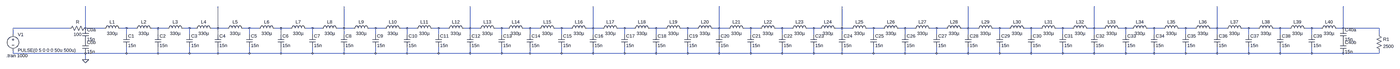
[diagram p0: schematic LTSpice Simulation.asc, whole sheet]
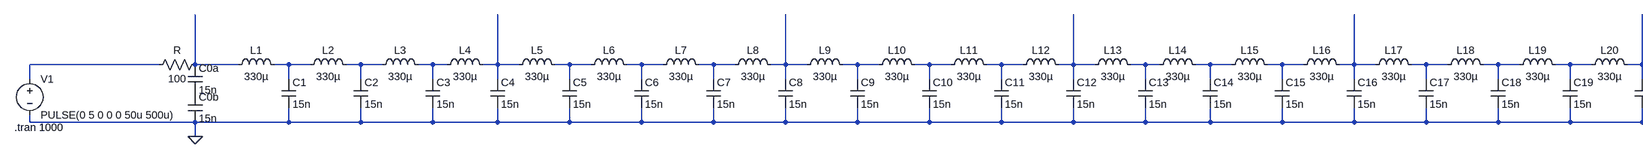
[diagram p1: schematic LTSpice Simulation.asc, part, row 1 of 1, column 1 of 2]
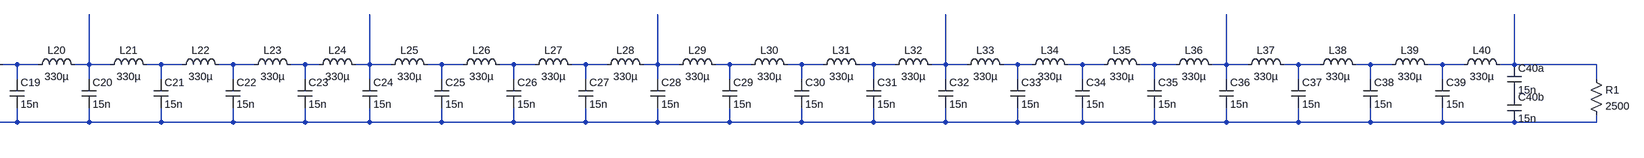
[diagram p2: schematic LTSpice Simulation.asc, part, row 1 of 1, column 2 of 2]
LTSpice Simulation.asc, the LTspice schematic file:
Version 4
SHEET 1 6812 680
WIRE 80 160 -208 160
WIRE 160 160 160 48
WIRE 256 160 160 160
WIRE 368 160 336 160
WIRE 416 160 368 160
WIRE 528 160 496 160
WIRE 576 160 528 160
WIRE 688 160 656 160
WIRE 720 160 688 160
WIRE 832 160 832 48
WIRE 832 160 800 160
WIRE 880 160 832 160
WIRE 992 160 960 160
WIRE 1040 160 992 160
WIRE 1152 160 1120 160
WIRE 1200 160 1152 160
WIRE 1312 160 1280 160
WIRE 1360 160 1312 160
WIRE 1472 160 1472 48
WIRE 1472 160 1440 160
WIRE 1520 160 1472 160
WIRE 1632 160 1600 160
WIRE 1680 160 1632 160
WIRE 1792 160 1760 160
WIRE 1840 160 1792 160
WIRE 1952 160 1920 160
WIRE 2000 160 1952 160
WIRE 2112 160 2112 48
WIRE 2112 160 2080 160
WIRE 2160 160 2112 160
WIRE 2272 160 2240 160
WIRE 2304 160 2272 160
WIRE 2416 160 2384 160
WIRE 2464 160 2416 160
WIRE 2576 160 2544 160
WIRE 2624 160 2576 160
WIRE 2736 160 2736 48
WIRE 2736 160 2704 160
WIRE 2784 160 2736 160
WIRE 2896 160 2864 160
WIRE 2944 160 2896 160
WIRE 3056 160 3024 160
WIRE 3104 160 3056 160
WIRE 3216 160 3184 160
WIRE 3264 160 3216 160
WIRE 3376 160 3376 48
WIRE 3376 160 3344 160
WIRE 3424 160 3376 160
WIRE 3536 160 3504 160
WIRE 3584 160 3536 160
WIRE 3696 160 3664 160
WIRE 3744 160 3696 160
WIRE 3856 160 3824 160
WIRE 3888 160 3856 160
WIRE 4000 160 4000 48
WIRE 4000 160 3968 160
WIRE 4048 160 4000 160
WIRE 4160 160 4128 160
WIRE 4208 160 4160 160
WIRE 4320 160 4288 160
WIRE 4368 160 4320 160
WIRE 4480 160 4448 160
WIRE 4528 160 4480 160
WIRE 4640 160 4640 48
WIRE 4640 160 4608 160
WIRE 4688 160 4640 160
WIRE 4800 160 4768 160
WIRE 4848 160 4800 160
WIRE 4960 160 4928 160
WIRE 5008 160 4960 160
WIRE 5120 160 5088 160
WIRE 5168 160 5120 160
WIRE 5280 160 5280 48
WIRE 5280 160 5248 160
WIRE 5328 160 5280 160
WIRE 5440 160 5408 160
WIRE 5472 160 5440 160
WIRE 5584 160 5552 160
WIRE 5632 160 5584 160
WIRE 5744 160 5712 160
WIRE 5792 160 5744 160
WIRE 5904 160 5904 48
WIRE 5904 160 5872 160
WIRE 5952 160 5904 160
WIRE 6064 160 6032 160
WIRE 6112 160 6064 160
WIRE 6224 160 6192 160
WIRE 6272 160 6224 160
WIRE 6384 160 6352 160
WIRE 6432 160 6384 160
WIRE 6544 160 6544 48
WIRE 6544 160 6512 160
WIRE 6736 160 6544 160
WIRE -208 192 -208 160
WIRE 368 192 368 160
WIRE 528 192 528 160
WIRE 688 192 688 160
WIRE 832 192 832 160
WIRE 992 192 992 160
WIRE 1152 192 1152 160
WIRE 1312 192 1312 160
WIRE 1472 192 1472 160
WIRE 1632 192 1632 160
WIRE 1792 192 1792 160
WIRE 1952 192 1952 160
WIRE 2112 192 2112 160
WIRE 2272 192 2272 160
WIRE 2416 192 2416 160
WIRE 2576 192 2576 160
WIRE 2736 192 2736 160
WIRE 2896 192 2896 160
WIRE 3056 192 3056 160
WIRE 3216 192 3216 160
WIRE 3376 192 3376 160
WIRE 3536 192 3536 160
WIRE 3696 192 3696 160
WIRE 3856 192 3856 160
WIRE 4000 192 4000 160
WIRE 4160 192 4160 160
WIRE 4320 192 4320 160
WIRE 4480 192 4480 160
WIRE 4640 192 4640 160
WIRE 4800 192 4800 160
WIRE 4960 192 4960 160
WIRE 5120 192 5120 160
WIRE 5280 192 5280 160
WIRE 5440 192 5440 160
WIRE 5584 192 5584 160
WIRE 5744 192 5744 160
WIRE 5904 192 5904 160
WIRE 6064 192 6064 160
WIRE 6224 192 6224 160
WIRE 6384 192 6384 160
WIRE 6736 192 6736 160
WIRE -208 288 -208 272
WIRE 160 288 -208 288
WIRE 368 288 368 256
WIRE 368 288 160 288
WIRE 528 288 528 256
WIRE 528 288 368 288
WIRE 688 288 688 256
WIRE 688 288 528 288
WIRE 832 288 832 256
WIRE 832 288 688 288
WIRE 992 288 992 256
WIRE 992 288 832 288
WIRE 1152 288 1152 256
WIRE 1152 288 992 288
WIRE 1312 288 1312 256
WIRE 1312 288 1152 288
WIRE 1472 288 1472 256
WIRE 1472 288 1312 288
WIRE 1632 288 1632 256
WIRE 1632 288 1472 288
WIRE 1792 288 1792 256
WIRE 1792 288 1632 288
WIRE 1952 288 1952 256
WIRE 1952 288 1792 288
WIRE 2112 288 2112 256
WIRE 2112 288 1952 288
WIRE 2272 288 2272 256
WIRE 2272 288 2112 288
WIRE 2416 288 2416 256
WIRE 2416 288 2272 288
WIRE 2576 288 2576 256
WIRE 2576 288 2416 288
WIRE 2736 288 2736 256
WIRE 2736 288 2576 288
WIRE 2896 288 2896 256
WIRE 2896 288 2736 288
WIRE 3056 288 3056 256
WIRE 3056 288 2896 288
WIRE 3216 288 3216 256
WIRE 3216 288 3056 288
WIRE 3376 288 3376 256
WIRE 3376 288 3216 288
WIRE 3536 288 3536 256
WIRE 3536 288 3376 288
WIRE 3696 288 3696 256
WIRE 3696 288 3536 288
WIRE 3856 288 3856 256
WIRE 3856 288 3696 288
WIRE 4000 288 4000 256
WIRE 4000 288 3856 288
WIRE 4160 288 4160 256
WIRE 4160 288 4000 288
WIRE 4320 288 4320 256
WIRE 4320 288 4160 288
WIRE 4480 288 4480 256
WIRE 4480 288 4320 288
WIRE 4640 288 4640 256
WIRE 4640 288 4480 288
WIRE 4800 288 4800 256
WIRE 4800 288 4640 288
WIRE 4960 288 4960 256
WIRE 4960 288 4800 288
WIRE 5120 288 5120 256
WIRE 5120 288 4960 288
WIRE 5280 288 5280 256
WIRE 5280 288 5120 288
WIRE 5440 288 5440 256
WIRE 5440 288 5280 288
WIRE 5584 288 5584 256
WIRE 5584 288 5440 288
WIRE 5744 288 5744 256
WIRE 5744 288 5584 288
WIRE 5904 288 5904 256
WIRE 5904 288 5744 288
WIRE 6064 288 6064 256
WIRE 6064 288 5904 288
WIRE 6224 288 6224 256
WIRE 6224 288 6064 288
WIRE 6384 288 6384 256
WIRE 6384 288 6224 288
WIRE 6544 288 6384 288
WIRE 6736 288 6736 272
WIRE 6736 288 6544 288
WIRE 160 320 160 288
FLAG 160 320 0
SYMBOL cap 144 160 R0
SYMATTR InstName C0a
SYMATTR Value 15n
SYMBOL cap 144 224 R0
SYMATTR InstName C0b
SYMATTR Value 15n
SYMBOL res 176 144 R90
WINDOW 0 0 56 VBottom 2
WINDOW 3 32 56 VTop 2
SYMATTR InstName R
SYMATTR Value 100
SYMBOL voltage -208 176 R0
WINDOW 123 0 0 Left 0
WINDOW 39 0 0 Left 0
SYMATTR InstName V1
SYMATTR Value PULSE(0 5 0 0 0 50u 500u)
SYMBOL ind 240 176 R270
WINDOW 0 32 56 VTop 2
WINDOW 3 5 56 VBottom 2
SYMATTR InstName L1
SYMATTR Value 330µ
SYMBOL cap 352 192 R0
SYMATTR InstName C1
SYMATTR Value 15n
SYMBOL ind 400 176 R270
WINDOW 0 32 56 VTop 2
WINDOW 3 5 56 VBottom 2
SYMATTR InstName L2
SYMATTR Value 330µ
SYMBOL cap 512 192 R0
SYMATTR InstName C2
SYMATTR Value 15n
SYMBOL ind 560 176 R270
WINDOW 0 32 56 VTop 2
WINDOW 3 5 56 VBottom 2
SYMATTR InstName L3
SYMATTR Value 330µ
SYMBOL cap 672 192 R0
SYMATTR InstName C3
SYMATTR Value 15n
SYMBOL ind 704 176 R270
WINDOW 0 32 56 VTop 2
WINDOW 3 5 56 VBottom 2
SYMATTR InstName L4
SYMATTR Value 330µ
SYMBOL cap 816 192 R0
SYMATTR InstName C4
SYMATTR Value 15n
SYMBOL ind 864 176 R270
WINDOW 0 32 56 VTop 2
WINDOW 3 5 56 VBottom 2
SYMATTR InstName L5
SYMATTR Value 330µ
SYMBOL cap 976 192 R0
SYMATTR InstName C5
SYMATTR Value 15n
SYMBOL ind 1024 176 R270
WINDOW 0 32 56 VTop 2
WINDOW 3 5 56 VBottom 2
SYMATTR InstName L6
SYMATTR Value 330µ
SYMBOL cap 1136 192 R0
SYMATTR InstName C6
SYMATTR Value 15n
SYMBOL ind 1184 176 R270
WINDOW 0 32 56 VTop 2
WINDOW 3 5 56 VBottom 2
SYMATTR InstName L7
SYMATTR Value 330µ
SYMBOL cap 1296 192 R0
SYMATTR InstName C7
SYMATTR Value 15n
SYMBOL ind 1344 176 R270
WINDOW 0 32 56 VTop 2
WINDOW 3 5 56 VBottom 2
SYMATTR InstName L8
SYMATTR Value 330µ
SYMBOL cap 1456 192 R0
SYMATTR InstName C8
SYMATTR Value 15n
SYMBOL ind 1504 176 R270
WINDOW 0 32 56 VTop 2
WINDOW 3 5 56 VBottom 2
SYMATTR InstName L9
SYMATTR Value 330µ
SYMBOL cap 1616 192 R0
SYMATTR InstName C9
SYMATTR Value 15n
SYMBOL ind 1664 176 R270
WINDOW 0 32 56 VTop 2
WINDOW 3 5 56 VBottom 2
SYMATTR InstName L10
SYMATTR Value 330µ
SYMBOL cap 1776 192 R0
SYMATTR InstName C10
SYMATTR Value 15n
SYMBOL ind 1824 176 R270
WINDOW 0 32 56 VTop 2
WINDOW 3 5 56 VBottom 2
SYMATTR InstName L11
SYMATTR Value 330µ
SYMBOL cap 1936 192 R0
SYMATTR InstName C11
SYMATTR Value 15n
SYMBOL ind 1984 176 R270
WINDOW 0 32 56 VTop 2
WINDOW 3 5 56 VBottom 2
SYMATTR InstName L12
SYMATTR Value 330µ
SYMBOL cap 2096 192 R0
SYMATTR InstName C12
SYMATTR Value 15n
SYMBOL ind 2144 176 R270
WINDOW 0 32 56 VTop 2
WINDOW 3 5 56 VBottom 2
SYMATTR InstName L13
SYMATTR Value 330µ
SYMBOL cap 2256 192 R0
SYMATTR InstName C13
SYMATTR Value 15n
SYMBOL ind 2288 176 R270
WINDOW 0 32 56 VTop 2
WINDOW 3 5 56 VBottom 2
SYMATTR InstName L14
SYMATTR Value 330µ
SYMBOL cap 2400 192 R0
SYMATTR InstName C14
SYMATTR Value 15n
SYMBOL ind 2448 176 R270
WINDOW 0 32 56 VTop 2
WINDOW 3 5 56 VBottom 2
SYMATTR InstName L15
SYMATTR Value 330µ
SYMBOL cap 2560 192 R0
SYMATTR InstName C15
SYMATTR Value 15n
SYMBOL ind 2608 176 R270
WINDOW 0 32 56 VTop 2
WINDOW 3 5 56 VBottom 2
SYMATTR InstName L16
SYMATTR Value 330µ
SYMBOL cap 2720 192 R0
SYMATTR InstName C16
SYMATTR Value 15n
SYMBOL ind 2768 176 R270
WINDOW 0 32 56 VTop 2
WINDOW 3 5 56 VBottom 2
SYMATTR InstName L17
SYMATTR Value 330µ
SYMBOL cap 2880 192 R0
SYMATTR InstName C17
SYMATTR Value 15n
SYMBOL ind 2928 176 R270
WINDOW 0 32 56 VTop 2
WINDOW 3 5 56 VBottom 2
SYMATTR InstName L18
SYMATTR Value 330µ
SYMBOL cap 3040 192 R0
SYMATTR InstName C18
SYMATTR Value 15n
SYMBOL ind 3088 176 R270
WINDOW 0 32 56 VTop 2
WINDOW 3 5 56 VBottom 2
SYMATTR InstName L19
SYMATTR Value 330µ
SYMBOL cap 3200 192 R0
SYMATTR InstName C19
SYMATTR Value 15n
SYMBOL ind 3248 176 R270
WINDOW 0 32 56 VTop 2
WINDOW 3 5 56 VBottom 2
SYMATTR InstName L20
SYMATTR Value 330µ
SYMBOL cap 3360 192 R0
SYMATTR InstName C20
SYMATTR Value 15n
SYMBOL ind 3408 176 R270
WINDOW 0 32 56 VTop 2
WINDOW 3 5 56 VBottom 2
SYMATTR InstName L21
SYMATTR Value 330µ
SYMBOL cap 3520 192 R0
SYMATTR InstName C21
SYMATTR Value 15n
SYMBOL ind 3568 176 R270
WINDOW 0 32 56 VTop 2
WINDOW 3 5 56 VBottom 2
SYMATTR InstName L22
SYMATTR Value 330µ
SYMBOL cap 3680 192 R0
SYMATTR InstName C22
SYMATTR Value 15n
SYMBOL ind 3728 176 R270
WINDOW 0 32 56 VTop 2
WINDOW 3 5 56 VBottom 2
SYMATTR InstName L23
SYMATTR Value 330µ
SYMBOL cap 3840 192 R0
SYMATTR InstName C23
SYMATTR Value 15n
SYMBOL ind 3872 176 R270
WINDOW 0 32 56 VTop 2
WINDOW 3 5 56 VBottom 2
SYMATTR InstName L24
SYMATTR Value 330µ
SYMBOL cap 3984 192 R0
SYMATTR InstName C24
SYMATTR Value 15n
SYMBOL ind 4032 176 R270
WINDOW 0 32 56 VTop 2
WINDOW 3 5 56 VBottom 2
SYMATTR InstName L25
SYMATTR Value 330µ
SYMBOL cap 4144 192 R0
SYMATTR InstName C25
SYMATTR Value 15n
SYMBOL ind 4192 176 R270
WINDOW 0 32 56 VTop 2
WINDOW 3 5 56 VBottom 2
SYMATTR InstName L26
SYMATTR Value 330µ
SYMBOL cap 4304 192 R0
SYMATTR InstName C26
SYMATTR Value 15n
SYMBOL ind 4352 176 R270
WINDOW 0 32 56 VTop 2
WINDOW 3 5 56 VBottom 2
SYMATTR InstName L27
SYMATTR Value 330µ
SYMBOL cap 4464 192 R0
SYMATTR InstName C27
SYMATTR Value 15n
SYMBOL ind 4512 176 R270
WINDOW 0 32 56 VTop 2
WINDOW 3 5 56 VBottom 2
SYMATTR InstName L28
SYMATTR Value 330µ
SYMBOL cap 4624 192 R0
SYMATTR InstName C28
SYMATTR Value 15n
SYMBOL ind 4672 176 R270
WINDOW 0 32 56 VTop 2
WINDOW 3 5 56 VBottom 2
SYMATTR InstName L29
SYMATTR Value 330µ
SYMBOL cap 4784 192 R0
SYMATTR InstName C29
SYMATTR Value 15n
SYMBOL ind 4832 176 R270
WINDOW 0 32 56 VTop 2
WINDOW 3 5 56 VBottom 2
SYMATTR InstName L30
SYMATTR Value 330µ
SYMBOL cap 4944 192 R0
SYMATTR InstName C30
SYMATTR Value 15n
SYMBOL ind 4992 176 R270
WINDOW 0 32 56 VTop 2
WINDOW 3 5 56 VBottom 2
SYMATTR InstName L31
SYMATTR Value 330µ
SYMBOL cap 5104 192 R0
SYMATTR InstName C31
SYMATTR Value 15n
SYMBOL ind 5152 176 R270
WINDOW 0 32 56 VTop 2
WINDOW 3 5 56 VBottom 2
SYMATTR InstName L32
SYMATTR Value 330µ
SYMBOL cap 5264 192 R0
SYMATTR InstName C32
SYMATTR Value 15n
SYMBOL ind 5312 176 R270
WINDOW 0 32 56 VTop 2
WINDOW 3 5 56 VBottom 2
SYMATTR InstName L33
SYMATTR Value 330µ
SYMBOL cap 5424 192 R0
SYMATTR InstName C33
SYMATTR Value 15n
SYMBOL ind 5456 176 R270
WINDOW 0 32 56 VTop 2
WINDOW 3 5 56 VBottom 2
SYMATTR InstName L34
SYMATTR Value 330µ
SYMBOL cap 5568 192 R0
SYMATTR InstName C34
SYMATTR Value 15n
SYMBOL ind 5616 176 R270
WINDOW 0 32 56 VTop 2
WINDOW 3 5 56 VBottom 2
SYMATTR InstName L35
SYMATTR Value 330µ
SYMBOL cap 5728 192 R0
SYMATTR InstName C35
SYMATTR Value 15n
SYMBOL ind 5776 176 R270
WINDOW 0 32 56 VTop 2
WINDOW 3 5 56 VBottom 2
SYMATTR InstName L36
SYMATTR Value 330µ
SYMBOL cap 5888 192 R0
SYMATTR InstName C36
SYMATTR Value 15n
SYMBOL ind 5936 176 R270
WINDOW 0 32 56 VTop 2
WINDOW 3 5 56 VBottom 2
SYMATTR InstName L37
SYMATTR Value 330µ
SYMBOL cap 6048 192 R0
SYMATTR InstName C37
SYMATTR Value 15n
SYMBOL ind 6096 176 R270
WINDOW 0 32 56 VTop 2
WINDOW 3 5 56 VBottom 2
SYMATTR InstName L38
SYMATTR Value 330µ
SYMBOL cap 6208 192 R0
SYMATTR InstName C38
SYMATTR Value 15n
SYMBOL ind 6256 176 R270
WINDOW 0 32 56 VTop 2
WINDOW 3 5 56 VBottom 2
SYMATTR InstName L39
SYMATTR Value 330µ
SYMBOL cap 6368 192 R0
SYMATTR InstName C39
SYMATTR Value 15n
SYMBOL ind 6416 176 R270
WINDOW 0 32 56 VTop 2
WINDOW 3 5 56 VBottom 2
SYMATTR InstName L40
SYMATTR Value 330µ
SYMBOL cap 6528 160 R0
SYMATTR InstName C40a
SYMATTR Value 15n
SYMBOL cap 6528 224 R0
SYMATTR InstName C40b
SYMATTR Value 15n
SYMBOL res 6720 176 R0
SYMATTR InstName R1
SYMATTR Value 2500
TEXT -242 300 Left 2 !.tran 1000

The netlist it stands for:
* LTSpice Simulation.asc
C0a N002 P001 15n
C0b P001 0 15n
R N002 N001 100
V1 N001 0 PULSE(0 5 0 0 0 50u 500u)
L1 N002 N003 330µ
C1 N003 0 15n
L2 N003 N004 330µ
C2 N004 0 15n
L3 N004 N005 330µ
C3 N005 0 15n
L4 N005 N006 330µ
C4 N006 0 15n
L5 N006 N007 330µ
C5 N007 0 15n
L6 N007 N008 330µ
C6 N008 0 15n
L7 N008 N009 330µ
C7 N009 0 15n
L8 N009 N010 330µ
C8 N010 0 15n
L9 N010 N011 330µ
C9 N011 0 15n
L10 N011 N012 330µ
C10 N012 0 15n
L11 N012 N013 330µ
C11 N013 0 15n
L12 N013 N014 330µ
C12 N014 0 15n
L13 N014 N015 330µ
C13 N015 0 15n
L14 N015 N016 330µ
C14 N016 0 15n
L15 N016 N017 330µ
C15 N017 0 15n
L16 N017 N018 330µ
C16 N018 0 15n
L17 N018 N019 330µ
C17 N019 0 15n
L18 N019 N020 330µ
C18 N020 0 15n
L19 N020 N021 330µ
C19 N021 0 15n
L20 N021 N022 330µ
C20 N022 0 15n
L21 N022 N023 330µ
C21 N023 0 15n
L22 N023 N024 330µ
C22 N024 0 15n
L23 N024 N025 330µ
C23 N025 0 15n
L24 N025 N026 330µ
C24 N026 0 15n
L25 N026 N027 330µ
C25 N027 0 15n
L26 N027 N028 330µ
C26 N028 0 15n
L27 N028 N029 330µ
C27 N029 0 15n
L28 N029 N030 330µ
C28 N030 0 15n
L29 N030 N031 330µ
C29 N031 0 15n
L30 N031 N032 330µ
C30 N032 0 15n
L31 N032 N033 330µ
C31 N033 0 15n
L32 N033 N034 330µ
C32 N034 0 15n
L33 N034 N035 330µ
C33 N035 0 15n
L34 N035 N036 330µ
C34 N036 0 15n
L35 N036 N037 330µ
C35 N037 0 15n
L36 N037 N038 330µ
C36 N038 0 15n
L37 N038 N039 330µ
C37 N039 0 15n
L38 N039 N040 330µ
C38 N040 0 15n
L39 N040 N041 330µ
C39 N041 0 15n
L40 N041 N042 330µ
C40a N042 P002 15n
C40b P002 0 15n
R1 N042 0 2500
.tran 1000
.backanno
.end